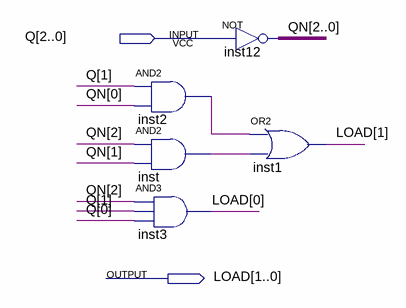
[diagram p0: schematic sheet]
// Quartus schematic LOAD.bdf as structural Verilog: 5 symbols, 2 pins
module LOAD (
  input  [2:0] Q,
  output [1:0] LOAD
);

  wire inst2_out, inst_out;
  wire [2:0] QN;

  and inst2 (inst2_out, Q[1], QN[0]);
  and inst (inst_out, QN[2], QN[1]);
  and inst3 (LOAD[0], QN[2], Q[1], Q[0]);
  assign QN = ~Q;  // NOT inst12, 3 bits wide
  or inst1 (LOAD[1], inst2_out, inst_out);
endmodule
